# Altium schematic sheet EtherWiz_ROM.SchDoc
size A3; SheetNumber: 4; SheetTotal: 4
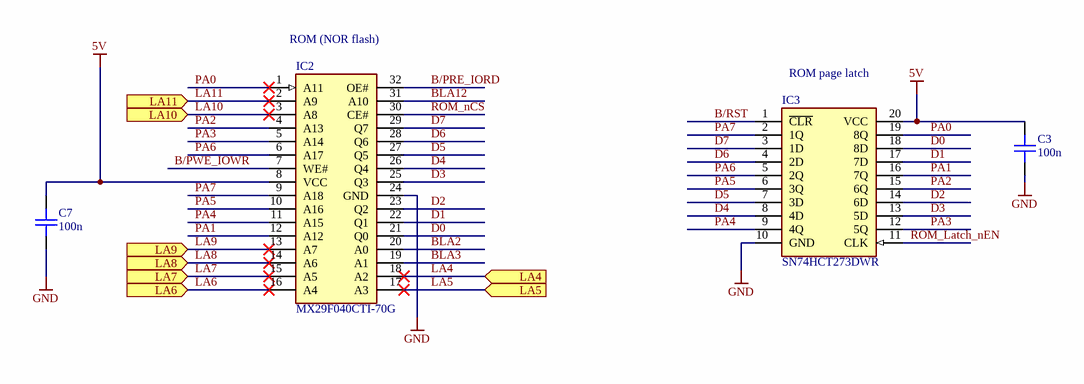
[diagram p0: EtherWiz_ROM.SchDoc]

## Parts
C3  100n  [CAPC1608L]
C7  100n  [CAPC1608L]
IC2  MX29F040CTI-70G  [SOP50P2000X120-32N]
IC3  SN74HCT273DWR  [SOIC127P1030X265-20N]

## Ports
LA4 (in, see EtherWiz_Mini[4B]), LA5 (in, see EtherWiz_Mini[4B]), LA6 (in, see EtherWiz_Mini[4B]), LA7 (in, see EtherWiz_Mini[4B]), LA8 (in, see EtherWiz_Mini[4B]), LA9 (in, see EtherWiz_Mini[4B]), LA10 (in, see EtherWiz_Mini[4B]), LA11 (in, see EtherWiz_Mini[4B])

## Nets
5V: C3.2 C7.2 IC2.8(VCC) IC3.20(VCC)
GND: C3.1 C7.1 IC2.24(GND) IC3.10(GND)
B/PRE_IORD: IC2.32(OE#)
B/PWE_IOWR: IC2.7(WE#)
B/RST: IC3.1(~{CLR})
BLA2: IC2.20(A0)
BLA3: IC2.19(A1)
BLA12: IC2.31(A10)
D0: IC2.21(Q0) IC3.18(8D)
D1: IC2.22(Q1) IC3.17(7D)
D2: IC2.23(Q2) IC3.14(6D)
D3: IC2.25(Q3) IC3.13(5D)
D4: IC2.26(Q4) IC3.8(4D)
D5: IC2.27(Q5) IC3.7(3D)
D6: IC2.28(Q6) IC3.4(2D)
D7: IC2.29(Q7) IC3.3(1D)
LA4: IC2.18(A2) ; port LA4
LA5: IC2.17(A3) ; port LA5
LA6: IC2.16(A4) ; port LA6
LA7: IC2.15(A5) ; port LA7
LA8: IC2.14(A6) ; port LA8
LA9: IC2.13(A7) ; port LA9
LA10: IC2.3(A8) ; port LA10
LA11: IC2.2(A9) ; port LA11
PA0: IC2.1(A11) IC3.19(8Q)
PA1: IC2.12(A12) IC3.16(7Q)
PA2: IC2.4(A13) IC3.15(6Q)
PA3: IC2.5(A14) IC3.12(5Q)
PA4: IC2.11(A15) IC3.9(4Q)
PA5: IC2.10(A16) IC3.6(3Q)
PA6: IC2.6(A17) IC3.5(2Q)
PA7: IC2.9(A18) IC3.2(1Q)
ROM_Latch_nEN: IC3.11(CLK)
ROM_nCS: IC2.30(CE#)

## Notes on the sheet
- (near IC2) ROM (NOR flash)
- (near IC3) ROM page latch
- SIZE
- DIMENSIONS
- TITLE
- VARIANT
- REVISION
- DATE
- A3
- SHEET
- OF
- FILE
- DRAWN BY

## Library data of the parts
C3 C7 = CAP_100n_0603_50V_0: CAP 100nF, 0603, 50V, X7R, 10%; Manufacturer1: Samsung; ManuPart1: CL10B104KB8NNNC; ManuPart2: CC0603KRX7R9BB104; Value: 100n; Distributor1: Anglia; Manufacturer2: Yageo; Distributor2: Digikey; Distributor1 Part No: CL10B104KB8NNNC; Distributor2 Part No: 311-1344-2-ND; ComponentLinknURL: *; ComponentLink1Description: ComponentLinknURL1; ComponentLink1URL: https://media.digikey.com/pdf/Data%20Sheets/Samsung%20PDFs/CL_Series_MLCC_ds.pdf; ComponentLink2Description: ComponentLinknURL2; ComponentLink2URL: https://www.yageo.com/upload/media/product/productsearch/datasheet/mlcc/UPY-GPHC_X7R_6.3V-to-50V_18.pdf; Voltage: 50V
IC2 = MX29F040CTI-70G: Integrated Circuit; Manufacturer_Name: Macronix; Datasheet Link: https://www.macronix.com/Lists/Datasheet/Attachments/7266/MX29F040C,%205V,%204Mb,%20v2.2.pdf; Height: 1.2mm; Manufacturer_Part_Number: MX29F040CTI-70G; Arrow Part Number: MX29F040CTI-70G; Arrow Price/Stock: https://www.arrow.com/en/products/mx29f040cti-70g/macronix-international?region=nac
IC3 = SN74HCT273DWR: Integrated Circuit; Manufacturer_Name: Texas Instruments; Datasheet Link: https://datasheet.datasheetarchive.com/originals/distributors/Datasheets-36/DSA-718641.pdf; Height: 2.65mm; Manufacturer_Part_Number: SN74HCT273DWR; Mouser Part Number: 595-SN74HCT273DWR; Mouser Price/Stock: https://www.mouser.co.uk/ProductDetail/Texas-Instruments/SN74HCT273DWR?qs=SL3LIuy2dWww%2FZr6up0MdA%3D%3D; Arrow Part Number: SN74HCT273DWR; Arrow Price/Stock: https://www.arrow.com/en/products/sn74hct273dwr/texas-instruments